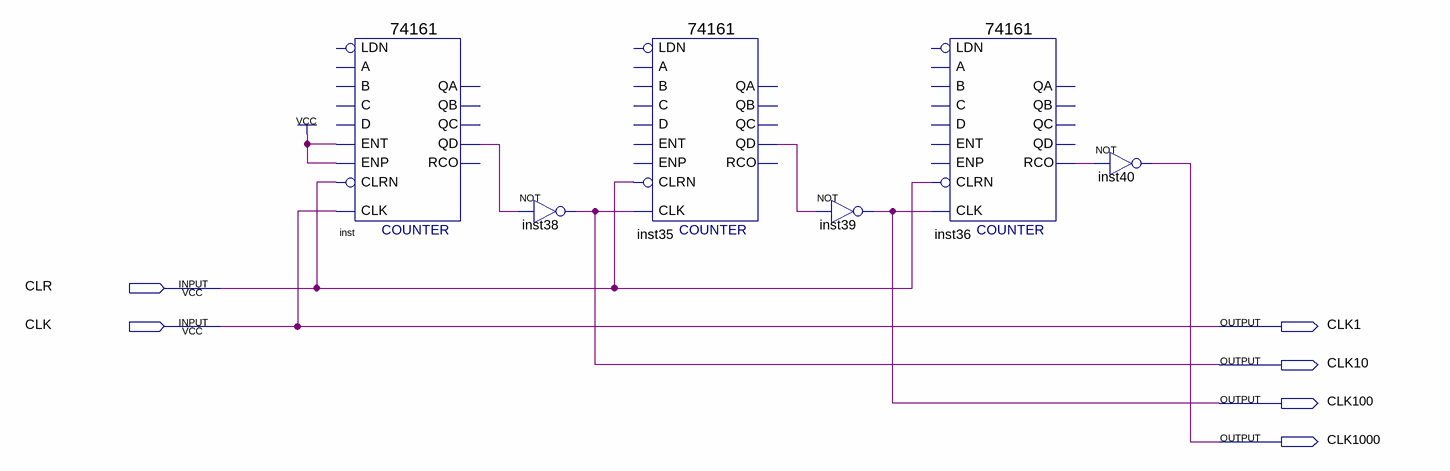
[diagram p0: schematic sheet]
// Quartus schematic Clock_Module.bdf as structural Verilog: 6 symbols, 6 pins
module Clock_Module (
  input  CLR,
  input  CLK,
  output CLK1,
  output CLK10,
  output CLK100,
  output CLK1000
);

  wire inst35_qd, inst36_rco, inst_qd;

  \74161  inst (.CLRN(CLR), .CLK(CLK), .ENP(1'b1), .ENT(1'b1), .QD(inst_qd));  // open: LDN, A, D, B, C, QC, QB, QA, RCO
  not inst38 (CLK10, inst_qd);
  \74161  inst35 (.CLRN(CLR), .CLK(CLK10), .QD(inst35_qd));  // open: ENP, LDN, A, D, ENT, B, C, QC, QB, QA, RCO
  not inst39 (CLK100, inst35_qd);
  \74161  inst36 (.CLRN(CLR), .CLK(CLK100), .RCO(inst36_rco));  // open: ENP, LDN, A, D, ENT, B, C, QD, QC, QB, QA
  not inst40 (CLK1000, inst36_rco);

  assign CLK1 = CLK;
endmodule
